# Altium schematic sheet [03] - POWER SUPPLY.SchDoc
size A4; DocumentNumber: 3; SheetNumber: 3; SheetTotal: 4
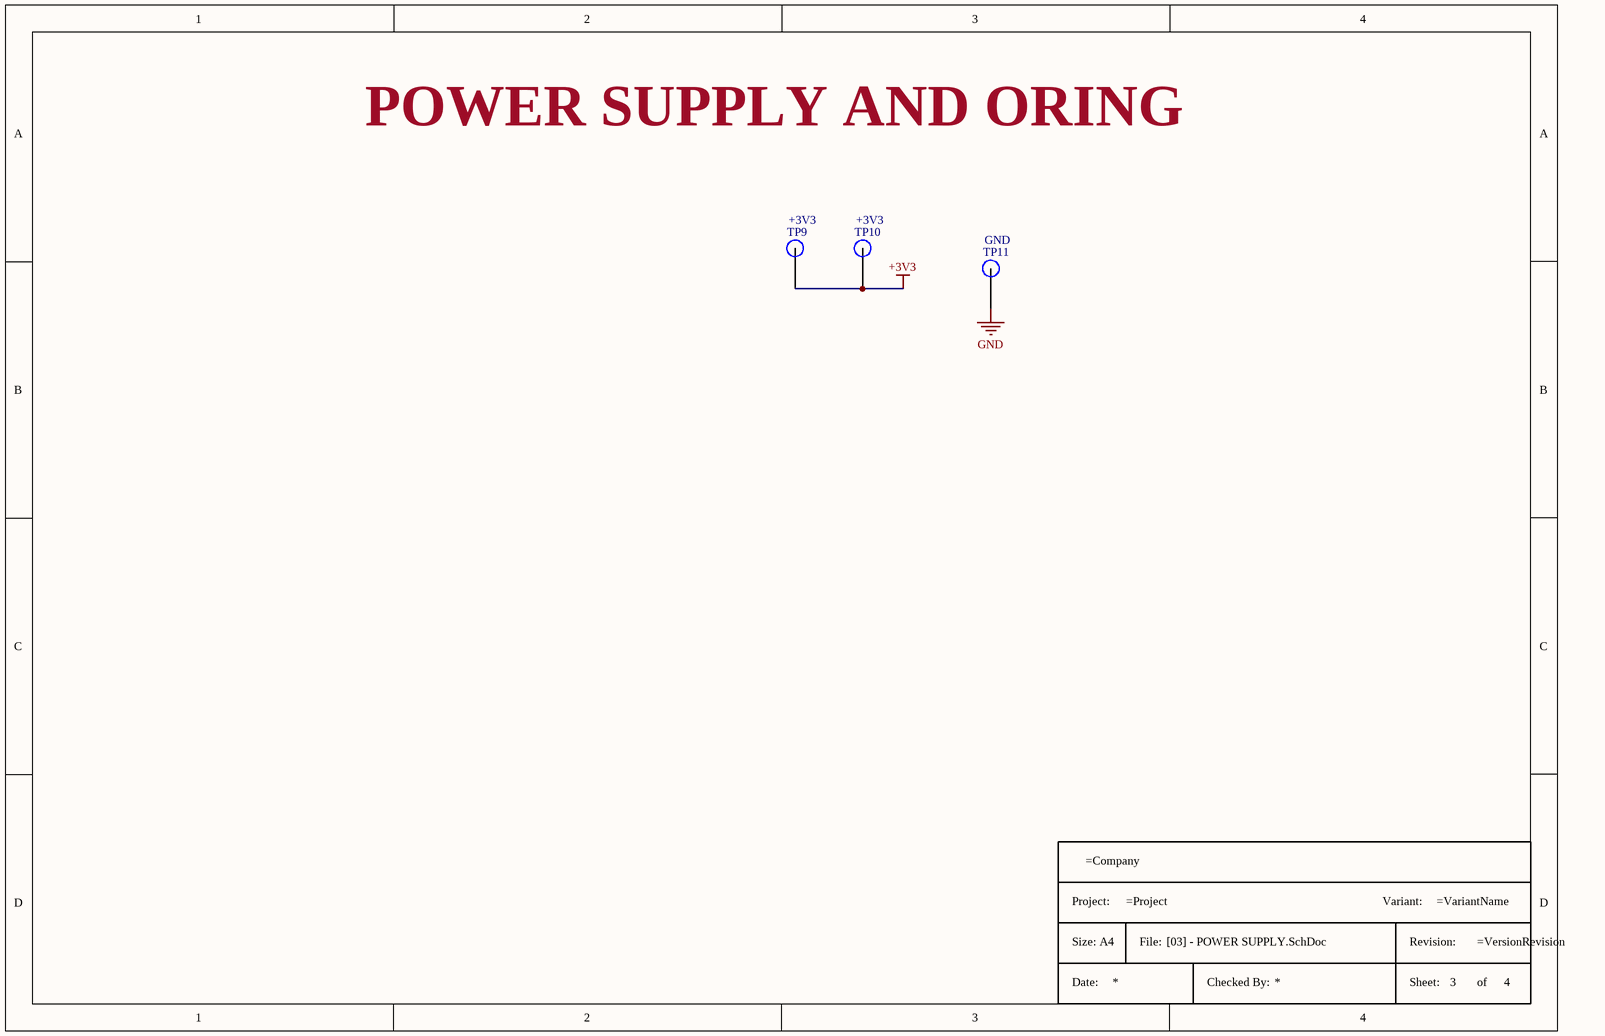
[diagram p0: [03] - POWER SUPPLY.SchDoc]

## Parts
*?  Title Block A4  (value not drawn)  (graphical)
TP9  +3V3  [Test Point]
TP10  +3V3  [Test Point]
TP11  GND  [Test Point]

## Nets
+3V3: TP9.1 TP10.1
GND: TP11.1

## Notes on the sheet
- POWER SUPPLY AND ORING
- (in symbol Title Block A4) Project:; Variant:; Size: A4; File:; Revision:; Date:; Checked By:; Sheet:; of

## Library data of the parts
TP9-TP11 = Test Point